# EAGLE design EnergyPal_v1.0 (EAGLE 9.7.0)
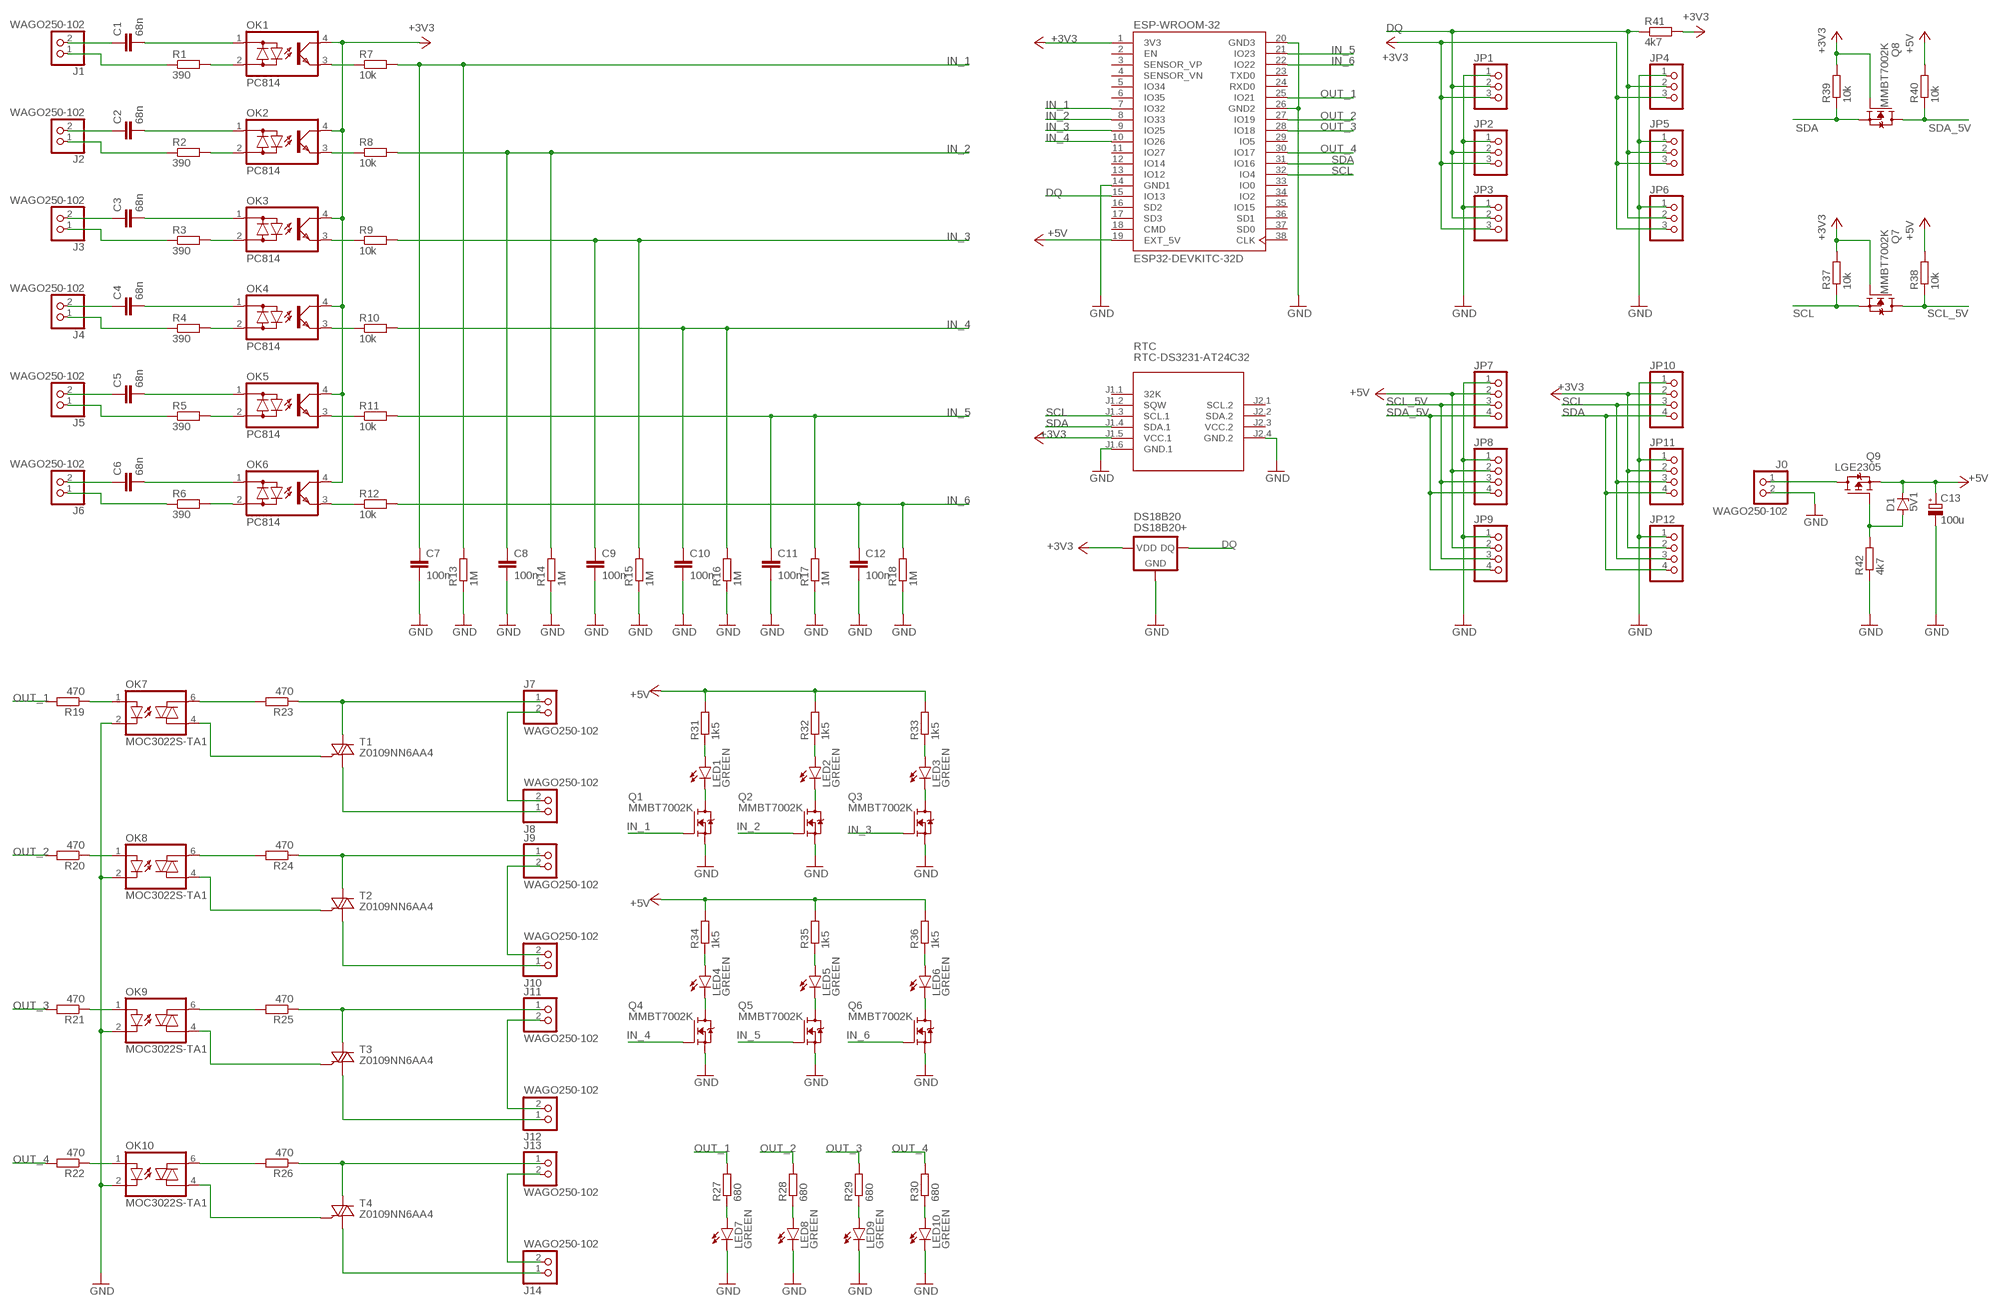
[diagram p0: schematic, sheet 1]

## Parts
C1  68n  C-EU075-063X106  [C075-063X106]
C2  68n  C-EU075-063X106  [C075-063X106]
C3  68n  C-EU075-063X106  [C075-063X106]
C4  68n  C-EU075-063X106  [C075-063X106]
C5  68n  C-EU075-063X106  [C075-063X106]
C6  68n  C-EU075-063X106  [C075-063X106]
C7  100n  C-EUC1206  [C1206]
C8  100n  C-EUC1206  [C1206]
C9  100n  C-EUC1206  [C1206]
C10  100n  C-EUC1206  [C1206]
C11  100n  C-EUC1206  [C1206]
C12  100n  C-EUC1206  [C1206]
C13  100u  CPOL-EUUD-6,3X7,7  [UD-6,3X7,7_NICHICON]
D1  5V1  DDZ9689-7  [SOD123]
DS18B20  DS18B20+  [TO92-]
ESP-WROOM-32  ESP32-DEVKITC-32D  [MODULE_ESP32-DEVKITC-32D]
J0  WAGO250-102  [250102]
J1  WAGO250-102  [250102]
J2  WAGO250-102  [250102]
J3  WAGO250-102  [250102]
J4  WAGO250-102  [250102]
J5  WAGO250-102  [250102]
J6  WAGO250-102  [250102]
J7  WAGO250-102  [250102]
J8  WAGO250-102  [250102]
J9  WAGO250-102  [250102]
J10  WAGO250-102  [250102]
J11  WAGO250-102  [250102]
J12  WAGO250-102  [250102]
J13  WAGO250-102  [250102]
J14  WAGO250-102  [250102]
JP1  PINHD-1X3  [1X03]
JP2  PINHD-1X3  [1X03]
JP3  PINHD-1X3  [1X03]
JP4  PINHD-1X3  [1X03]
JP5  PINHD-1X3  [1X03]
JP6  PINHD-1X3  [1X03]
JP7  PINHD-1X4  [1X04]
JP8  PINHD-1X4  [1X04]
JP9  PINHD-1X4  [1X04]
JP10  PINHD-1X4  [1X04]
JP11  PINHD-1X4  [1X04]
JP12  PINHD-1X4  [1X04]
LED1  GREEN  LEDSMT1206  [1206]
LED2  GREEN  LEDSMT1206  [1206]
LED3  GREEN  LEDSMT1206  [1206]
LED4  GREEN  LEDSMT1206  [1206]
LED5  GREEN  LEDSMT1206  [1206]
LED6  GREEN  LEDSMT1206  [1206]
LED7  GREEN  LEDSMT1206  [1206]
LED8  GREEN  LEDSMT1206  [1206]
LED9  GREEN  LEDSMT1206  [1206]
LED10  GREEN  LEDSMT1206  [1206]
OK1  PC814  [SOP254P960X420-4N]
OK2  PC814  [SOP254P960X420-4N]
OK3  PC814  [SOP254P960X420-4N]
OK4  PC814  [SOP254P960X420-4N]
OK5  PC814  [SOP254P960X420-4N]
OK6  PC814  [SOP254P960X420-4N]
OK7  MOC3022S-TA1  [SOP254P1016X460-6N]
OK8  MOC3022S-TA1  [SOP254P1016X460-6N]
OK9  MOC3022S-TA1  [SOP254P1016X460-6N]
OK10  MOC3022S-TA1  [SOP254P1016X460-6N]
Q1  MMBT7002K  [SOT23]
Q2  MMBT7002K  [SOT23]
Q3  MMBT7002K  [SOT23]
Q4  MMBT7002K  [SOT23]
Q5  MMBT7002K  [SOT23]
Q6  MMBT7002K  [SOT23]
Q7  MMBT7002K  [SOT23]
Q8  MMBT7002K  [SOT23]
Q9  LGE2305  [SOT23]
R1  390  R-EU_R1206  [R1206]
R2  390  R-EU_R1206  [R1206]
R3  390  R-EU_R1206  [R1206]
R4  390  R-EU_R1206  [R1206]
R5  390  R-EU_R1206  [R1206]
R6  390  R-EU_R1206  [R1206]
R7  10k  R-EU_R1206  [R1206]
R8  10k  R-EU_R1206  [R1206]
R9  10k  R-EU_R1206  [R1206]
R10  10k  R-EU_R1206  [R1206]
R11  10k  R-EU_R1206  [R1206]
R12  10k  R-EU_R1206  [R1206]
R13  1M  R-EU_R1206  [R1206]
R14  1M  R-EU_R1206  [R1206]
R15  1M  R-EU_R1206  [R1206]
R16  1M  R-EU_R1206  [R1206]
R17  1M  R-EU_R1206  [R1206]
R18  1M  R-EU_R1206  [R1206]
R19  470  R-EU_R1206  [R1206]
R20  470  R-EU_R1206  [R1206]
R21  470  R-EU_R1206  [R1206]
R22  470  R-EU_R1206  [R1206]
R23  470  R-EU_R1206  [R1206]
R24  470  R-EU_R1206  [R1206]
R25  470  R-EU_R1206  [R1206]
R26  470  R-EU_R1206  [R1206]
R27  680  R-EU_R1206  [R1206]
R28  680  R-EU_R1206  [R1206]
R29  680  R-EU_R1206  [R1206]
R30  680  R-EU_R1206  [R1206]
R31  1k5  R-EU_R1206  [R1206]
R32  1k5  R-EU_R1206  [R1206]
R33  1k5  R-EU_R1206  [R1206]
R34  1k5  R-EU_R1206  [R1206]
R35  1k5  R-EU_R1206  [R1206]
R36  1k5  R-EU_R1206  [R1206]
R37  10k  R-EU_R1206  [R1206]
R38  10k  R-EU_R1206  [R1206]
R39  10k  R-EU_R1206  [R1206]
R40  10k  R-EU_R1206  [R1206]
R41  4k7  R-EU_R1206  [R1206]
R42  4k7  R-EU_R1206  [R1206]
RTC  RTC-DS3231-AT24C32  [RTC-DS3231-AT24C32#MIRROR]
T1  Z0109NN6AA4  [SOT230P700X190-4N]
T2  Z0109NN6AA4  [SOT230P700X190-4N]
T3  Z0109NN6AA4  [SOT230P700X190-4N]
T4  Z0109NN6AA4  [SOT230P700X190-4N]

## Nets
+3V3: DS18B20.3(VDD) ESP-WROOM-32.1(3V3) JP1.3 JP2.3 JP3.3 JP4.3 JP5.3 JP6.3 JP10.2 JP11.2 JP12.2 OK1.4(C) OK2.4(C) OK3.4(C) OK4.4(C) OK5.4(C) OK6.4(C) Q7.1(G) Q8.1(G) R37.2 R39.2 R41.2 RTC.J1.5(VCC.1)
+5V: C13.+ D1.C ESP-WROOM-32.19(EXT_5V) JP7.2 JP8.2 JP9.2 Q9.2(S) R31.2 R32.2 R33.2 R34.2 R35.2 R36.2 R38.2 R40.2
DQ: DS18B20.2(DQ) ESP-WROOM-32.15(IO13) JP1.2 JP2.2 JP3.2 JP4.2 JP5.2 JP6.2 R41.1
GND: C7.2 C8.2 C9.2 C10.2 C11.2 C12.2 C13.- DS18B20.1(GND) ESP-WROOM-32.14(GND1) ESP-WROOM-32.20(GND3) ESP-WROOM-32.26(GND2) J0.2 JP1.1 JP2.1 JP3.1 JP4.1 JP5.1 JP6.1 JP7.1 JP8.1 JP9.1 JP10.1 JP11.1 JP12.1 LED7.C LED8.C LED9.C LED10.C OK7.2(C) OK8.2(C) OK9.2(C) OK10.2(C) Q1.2(S) Q2.2(S) Q3.2(S) Q4.2(S) Q5.2(S) Q6.2(S) R13.1 R14.1 R15.1 R16.1 R17.1 R18.1 R42.1 RTC.J1.6(GND.1) RTC.J2.4(GND.2)
IN_1: C7.1 ESP-WROOM-32.7(IO32) Q1.1(G) R7.2 R13.2
IN_2: C8.1 ESP-WROOM-32.8(IO33) Q2.1(G) R8.2 R14.2
IN_3: C9.1 ESP-WROOM-32.9(IO25) Q3.1(G) R9.2 R15.2
IN_4: C10.1 ESP-WROOM-32.10(IO26) Q4.1(G) R10.2 R16.2
IN_5: C11.1 ESP-WROOM-32.21(IO23) Q5.1(G) R11.2 R17.2
IN_6: C12.1 ESP-WROOM-32.22(IO22) Q6.1(G) R12.2 R18.2
N$1: C1.1 J1.2
N$2: C1.2 OK1.1(AC1)
N$3: OK6.2(AC2) R6.2
N$4: J6.1 R6.1
N$5: C2.1 J2.2
N$6: C2.2 OK2.1(AC1)
N$7: J2.1 R2.1
N$8: OK2.2(AC2) R2.2
N$9: OK4.3(E) R10.1
N$10: OK3.3(E) R9.1
N$11: OK2.3(E) R8.1
N$12: OK1.3(E) R7.1
N$13: OK7.1(A) R19.1
N$14: OK7.6(A2) R23.2
N$15: OK8.1(A) R20.1
N$16: J1.1 R1.1
N$17: OK8.6(A2) R24.2
N$18: OK1.2(AC2) R1.2
N$19: C3.1 J3.2
N$20: J9.1 R24.1 T2.2(A2) T2.4(A2)
N$21: OK8.4(A1) T2.3(G)
N$22: J10.1 T2.1(A1)
N$23: J9.2 J10.2
N$24: J0.1 Q9.3(D)
N$25: C3.2 OK3.1(AC1)
N$26: OK9.1(A) R21.1
N$27: J7.2 J8.2
N$28: OK9.6(A2) R25.2
N$29: J3.1 R3.1
N$30: OK3.2(AC2) R3.2
N$31: J11.1 R25.1 T3.2(A2) T3.4(A2)
N$32: OK9.4(A1) T3.3(G)
N$33: C4.1 J4.2
N$34: C4.2 OK4.1(AC1)
N$35: J4.1 R4.1
N$36: OK4.2(AC2) R4.2
N$37: C5.1 J5.2
N$38: C5.2 OK5.1(AC1)
N$39: J5.1 R5.1
N$40: LED1.C Q1.3(D)
N$41: D1.A Q9.1(G) R42.2
N$42: LED7.A R27.1
N$43: LED1.A R31.1
N$44: LED2.A R32.1
N$45: LED2.C Q2.3(D)
N$46: LED8.A R28.1
N$47: LED3.A R33.1
N$48: LED3.C Q3.3(D)
N$49: OK5.2(AC2) R5.2
N$50: LED9.A R29.1
N$51: C6.1 J6.2
N$52: OK5.3(E) R11.1
N$53: C6.2 OK6.1(AC1)
N$55: OK6.3(E) R12.1
N$57: LED4.A R34.1
N$59: LED4.C Q4.3(D)
N$61: LED10.A R30.1
N$63: LED5.A R35.1
N$65: LED5.C Q5.3(D)
N$67: J7.1 R23.1 T1.2(A2) T1.4(A2)
N$69: LED6.A R36.1
N$70: LED6.C Q6.3(D)
N$71: OK7.4(A1) T1.3(G)
N$72: J8.1 T1.1(A1)
N$73: J12.1 T3.1(A1)
N$75: J11.2 J12.2
N$77: OK10.1(A) R22.1
N$78: OK10.6(A2) R26.2
N$81: J13.1 R26.1 T4.2(A2) T4.4(A2)
N$82: OK10.4(A1) T4.3(G)
N$83: J14.1 T4.1(A1)
N$84: J13.2 J14.2
OUT_1: ESP-WROOM-32.25(IO21) R19.2 R27.2
OUT_2: ESP-WROOM-32.27(IO19) R20.2 R28.2
OUT_3: ESP-WROOM-32.28(IO18) R21.2 R29.2
OUT_4: ESP-WROOM-32.30(IO17) R22.2 R30.2
SCL: ESP-WROOM-32.32(IO4) JP10.3 JP11.3 JP12.3 Q7.2(S) R37.1 RTC.J1.3(SCL.1)
SCL_5V: JP7.3 JP8.3 JP9.3 Q7.3(D) R38.1
SDA: ESP-WROOM-32.31(IO16) JP10.4 JP11.4 JP12.4 Q8.2(S) R39.1 RTC.J1.4(SDA.1)
SDA_5V: JP7.4 JP8.4 JP9.4 Q8.3(D) R40.1
Unconnected: ESP-WROOM-32.2(EN) ESP-WROOM-32.3(SENSOR_VP) ESP-WROOM-32.4(SENSOR_VN) ESP-WROOM-32.5(IO34) ESP-WROOM-32.6(IO35) ESP-WROOM-32.11(IO27) ESP-WROOM-32.12(IO14) ESP-WROOM-32.13(IO12) ESP-WROOM-32.16(SD2) ESP-WROOM-32.17(SD3) ESP-WROOM-32.18(CMD) ESP-WROOM-32.23(TXD0) ESP-WROOM-32.24(RXD0) ESP-WROOM-32.29(IO5) ESP-WROOM-32.33(IO0) ESP-WROOM-32.34(IO2) ESP-WROOM-32.35(IO15) ESP-WROOM-32.36(SD1) ESP-WROOM-32.37(SD0) ESP-WROOM-32.38(CLK) RTC.J1.1(32K) RTC.J1.2(SQW) RTC.J2.1(SCL.2) RTC.J2.2(SDA.2)

## Power pins joined to a net without a drawn wire
VCC.2: RTC.J2.3(VCC.2)

## Library data of the parts
C1-C12 = rcl:C-EU: CAPACITOR, European symbol; SPICEPREFIX: C
C13 = rcl:CPOL-EU: POLARIZED CAPACITOR, European symbol; SPICEPREFIX: C
D1 = Spectrasol:DDZ9689-7
DS18B20 = Spectrasol:DS18B20
ESP-WROOM-32 = diy-modules:ESP32-DEVKITC-32D: Eval Board For Esp-Wroom-32; AVAILABILITY: Unavailable; DESCRIPTION: - Transceiver; 802.11 b/g/n _Wi-Fi, WiFi, WLAN_, Bluetooth® Smart Ready 4.x Dual Mode For Use With ESP-WROOM-32; MF: Espressif Systems; MP: ESP32-DEVKITC-32D; PACKAGE: None; PRICE: None
J0 J1-J14 = LUNA Controller:WAGO250-102: PCB terminal block; push-button; 1.5 mm; Pin spacing 3.5 mm; 2-pole; Push-in CAGE CLAMP Source: Datasheet <https://www.wago.com/250-102>; DESCRIPTION: PCB terminal block; push-button; 1.5 mm; Pin spacing 3.5 mm; 2-pole; Push-in CAGE CLAMP; HEIGHT: 13.1mm; MANUFACTURER_NAME: Wago; MANUFACTURER_PART_NUMBER: 250-102
JP1-JP6 = pinhead:PINHD-1X3: PIN HEADER
JP7-JP12 = pinhead:PINHD-1X4: PIN HEADER
LED1-LED10 = led:LED: LED OSRAM: - CHIPLED LG R971, LG N971, LY N971, LG Q971, LY Q971, LO R971, LY R971 LH N974, LH R974 LS Q976, LO Q976, LY Q976 LO Q996 - Hyper CHIPLED LW Q18S LB Q993, LB Q99A, LB R99A - SideLED LS A670, LO A670, LY A670, LG A670, LP A670 LB A673, LV A673, LT A673, LW A673 LH A674 LY A675 LS A676, LA A676, LO A676, LY A676, LW A676 LS A679, LY A679, LG A679 - Hyper Micro SIDELED® LS Y876, LA Y876, LO Y876, LY Y876 LT Y87S - SmartLED LW L88C, LW L88S LB L89C, LB L89S, LG L890 LS L89K, LO L89K, LY L89K LS L896, LA L896, LO L896, LY L896 - TOPLED LS T670, LO T670, LY T670, LG T670, LP T670 LSG T670, LSP T670, LSY T670, LOP T670, LYG T670 LG T671, LOG T671, LSG T671 LB T673, LV T673, LT T673, LW T673 LH T674 LS T676, LA T676, LO T676, LY T676, LB T676, LH T676, LSB T676, LW T676 LB T67C, LV T67C, LT T67C, LS T67K, LO T67K, LY T67K, LW E67C LS E67B, LA E67B, LO E67B, LY E67B, LB E67C, LV E67C, LT E67C LW T67C LS T679, LY T679, LG T679 LS T770, LO T770, LY T770, LG T770, LP T770 LB T773, LV T773, LT T773, LW T773 LH T774 LS E675, LA E675, LY E675, LS T675 LS T776, LA T776, LO T776, LY T776, LB T776 LHGB T686 LT T68C, LB T68C - Hyper Mini TOPLED® LB M676 - Mini TOPLED Santana® LG M470 LS M47K, LO M47K, LY M47K Source: http://www.osram.convergy.de LUXEON: - LUMILED® LXK2-PW12-R00, LXK2-PW12-S00, LXK2-PW14-U00, LXK2-PW14-V00 LXK2-PM12-R00, LXK2-PM12-S00, LXK2-PM14-U00 LXK2-PE12-Q00, LXK2-PE12-R00, LXK2-PE12-S00, LXK2-PE14-T00, LXK2-PE14-U00 LXK2-PB12-K00, LXK2-PB12-L00, LXK2-PB12-M00, LXK2-PB14-N00, LXK2-PB14-P00, LXK2-PB14-Q00 LXK2-PR12-L00, LXK2-PR12-M00, LXK2-PR14-Q00, LXK2-PR14-R00 LXK2-PD12-Q00, LXK2-PD12-R00, LXK2-PD12-S00 LXK2-PH12-R00, LXK2-PH12-S00 LXK2-PL12-P00, LXK2-PL12-Q00, LXK2-PL12-R00 Source: www.luxeon.com KINGBRIGHT: KA-3528ASYC Source: www.kingbright.com
OK1-OK6 = maturitni_prace:PC814
OK7-OK10 = maturitni_prace:MOC3022S-TA1
Q1-Q8 = DoorOpener:MMBT7002K
Q9 = Spectrasol:LGE2305
R1-R42 = rcl:R-EU_: RESISTOR, European symbol; SPICEPREFIX: R
RTC = maturitni_prace:RTC-DS3231-AT24C32
T1-T4 = maturitni_prace:Z0109NN6AA4

## Board
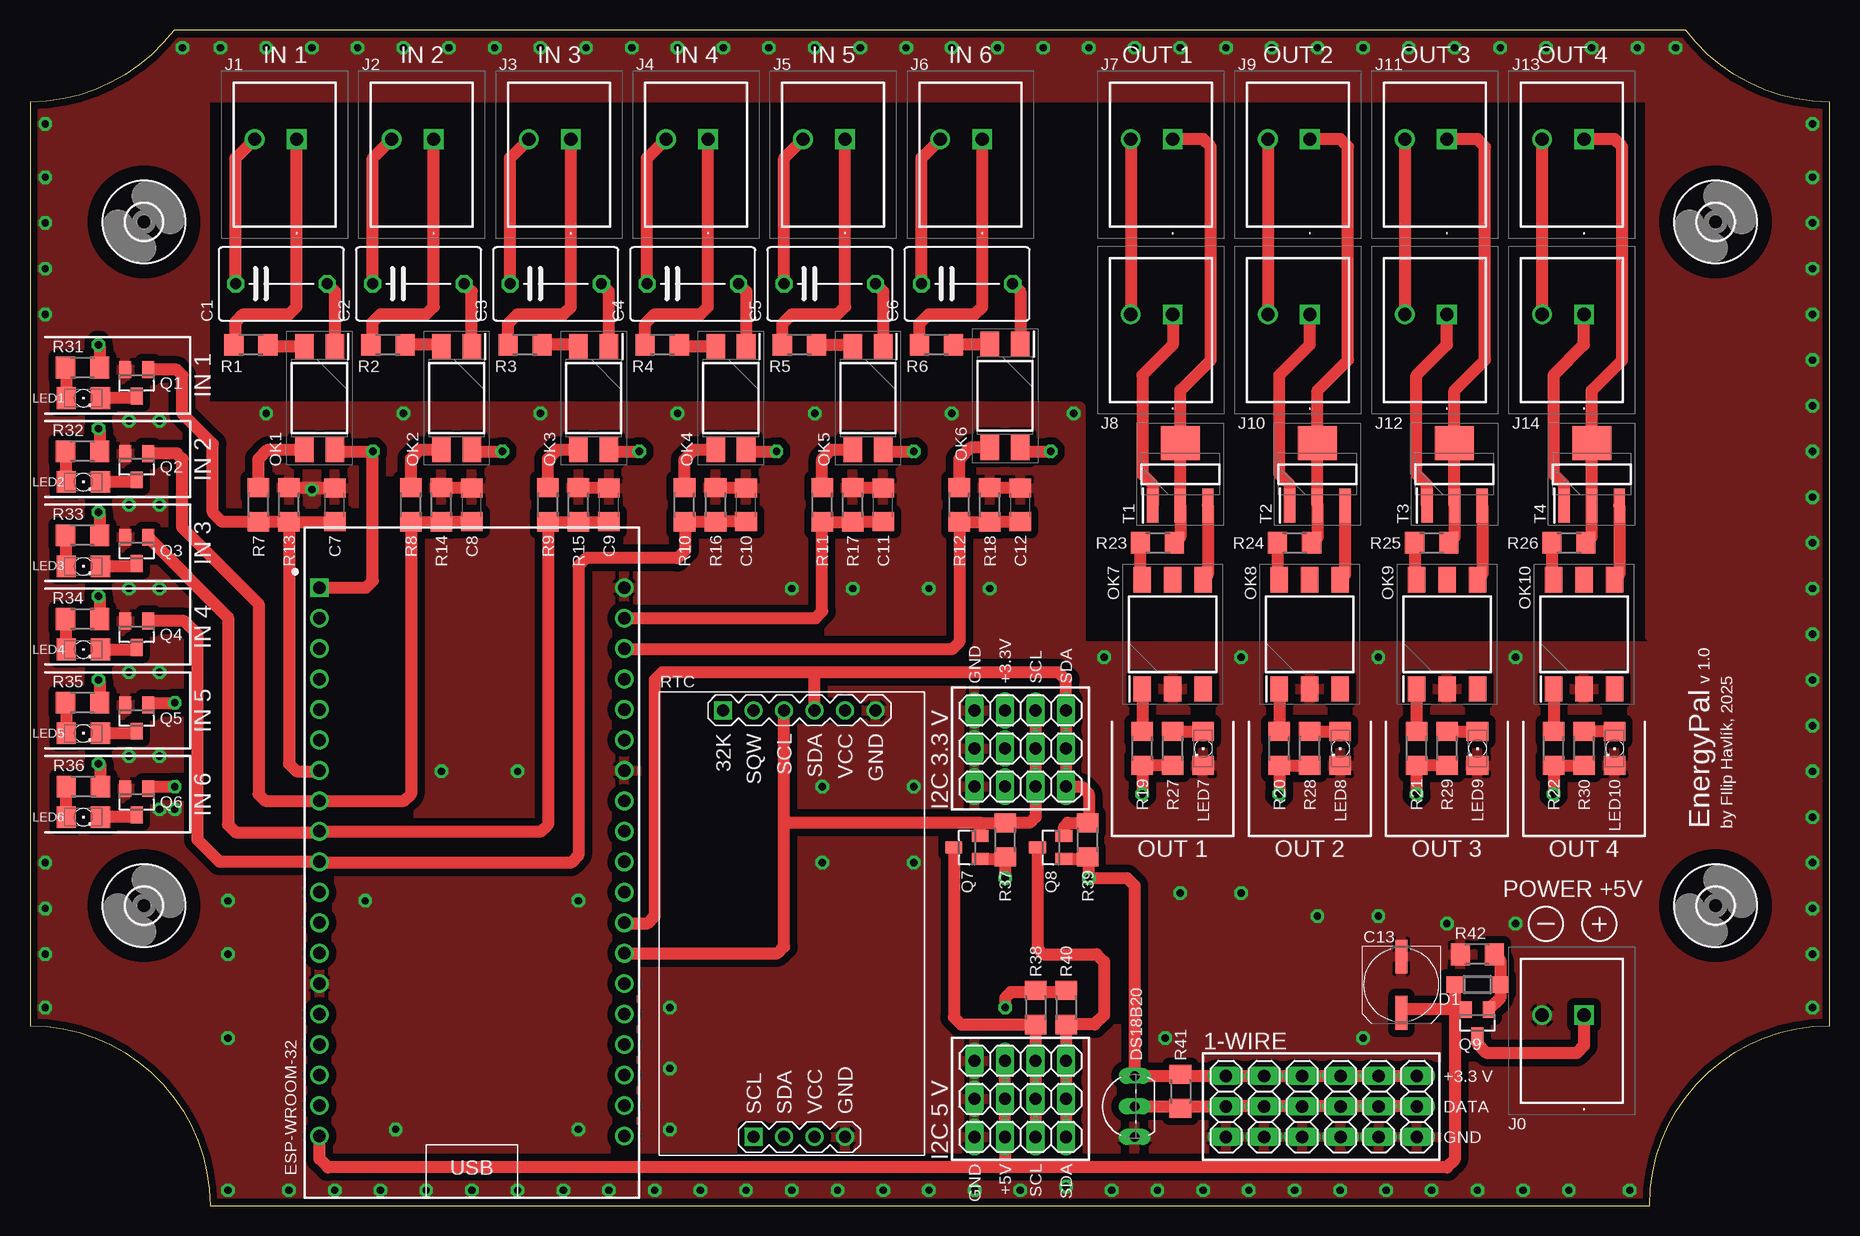
[diagram p1: board, top side]
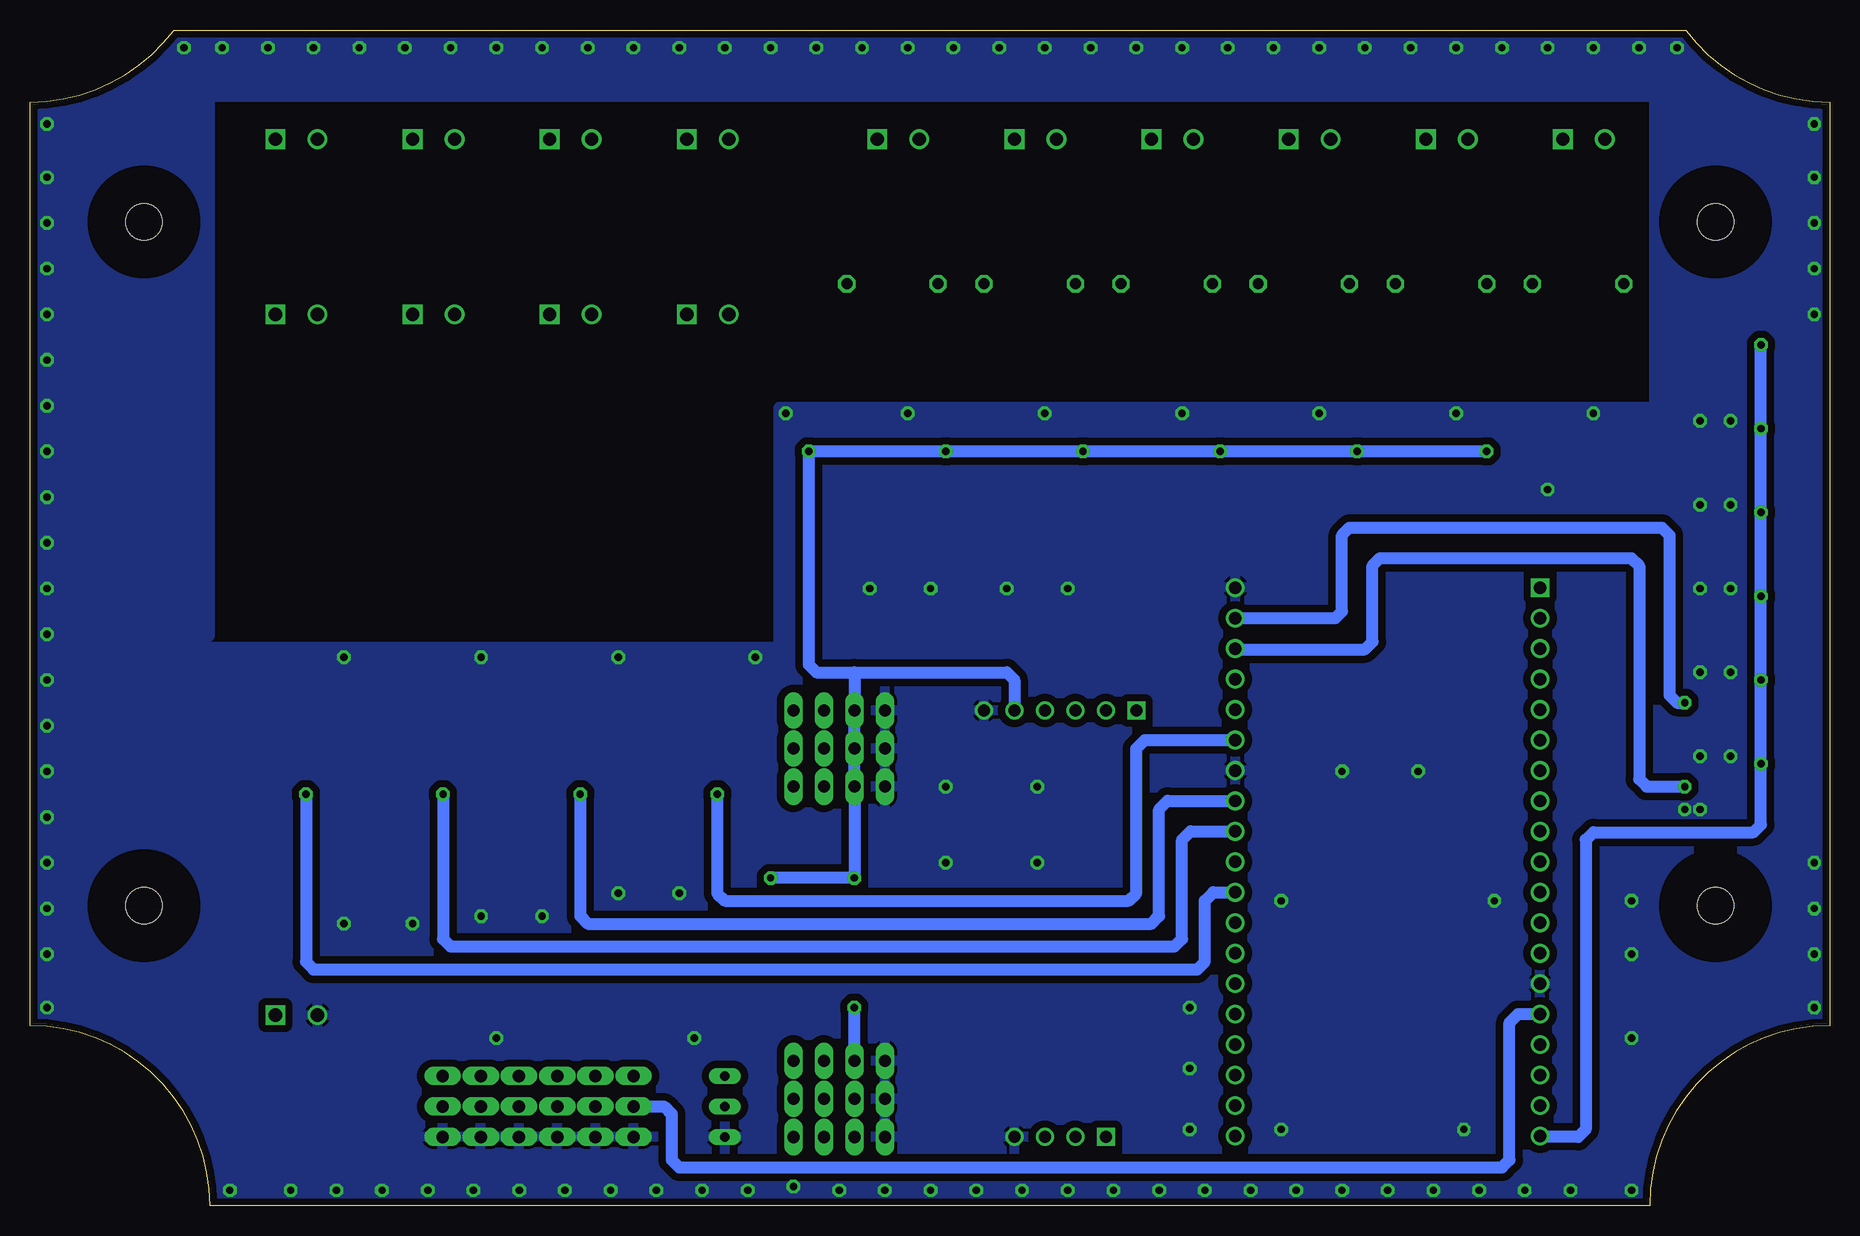
[diagram p2: board, bottom side, seen from below]

Size 150 x 98 mm. Coordinates in mm from the lower left corner, seen from the top.
Outline: 15,0 135,0 arc-90 150,15 150,92 arc-53 138,98 12,98 arc-53 0,92 0,15 arc-90 15,0
Copper layers (1*16): Top 0.035mm / dielectric 1.5mm / Bottom 0.035mm
Design rules "gatema.dru": minimum track width 8mil, minimum drill 8mil, track to track 4mil, track to pad 4mil, pad to pad 4mil, via to via 4mil, smd to smd 4mil, copper to edge 8mil, drill to drill 8mil, minimum pad ring 10mil, minimum via ring 10mil, stop-mask expansion 2mil, vias tented up to drill 0mil, thermal gap 10mil

### Footprints (pad centres in the part's own frame; a part is rotated, then mirrored left to right if it is on the bottom)
C075-063X106 = drill 0.914 octagon: 1 -3.81,0; 2 3.81,0
C1206 = smd 1.6 x 1.8: 1 -1.4,0; 2 1.4,0
UD-6,3X7,7_NICHICON = smd 2.8 x 1: + 2.35,0; - -2.35,0
SOD123 = smd 1.4 x 1.4: A 1.9,0; C -1.9,0
TO92- = drill 0.813 long: 1 -2.54,0; 2 0,0; 3 2.54,0
MODULE_ESP32-DEVKITC-32D = drill 1.04 square: 1 -12.7,19.76 | drill 1.04: 2 -12.7,17.22; 3 -12.7,14.68; 4 -12.7,12.14; 5 -12.7,9.6; 6 -12.7,7.06; 7 -12.7,4.52; 8 -12.7,1.98; 9 -12.7,-0.56; 10 -12.7,-3.1; 11 -12.7,-5.64; 12 -12.7,-8.18; 13 -12.7,-10.72; 14 -12.7,-13.26; 15 -12.7,-15.8; 16 -12.7,-18.34; 17 -12.7,-20.88; 18 -12.7,-23.42; 19 -12.7,-25.96; 20 12.7,19.76; 21 12.7,17.22; 22 12.7,14.68; 23 12.7,12.14; 24 12.7,9.6; 25 12.7,7.06; 26 12.7,4.52; 27 12.7,1.98; 28 12.7,-0.56; 29 12.7,-3.1; 30 12.7,-5.64; 31 12.7,-8.18; 32 12.7,-10.72; 33 12.7,-13.26; 34 12.7,-15.8; 35 12.7,-18.34; 36 12.7,-20.88; 37 12.7,-23.42; 38 12.7,-25.96
250102 = drill 1.1 pad 1.65 square: 1 0,0 | drill 1.1 pad 1.65: 2 3.5,0
1X03 = drill 1.016 long: 1 -2.54,0; 2 0,0; 3 2.54,0
1X04 = drill 1.016 long: 1 -3.81,0; 2 -1.27,0; 3 1.27,0; 4 3.81,0
1206 = smd 1.6 x 1.803: A -1.422,0; C 1.422,0
SOP254P960X420-4N = smd 2.1 x 1.55: 1 -4.3,1.27; 2 -4.3,-1.27; 3 4.3,-1.27; 4 4.3,1.27
SOP254P1016X460-6N = smd 2.1 x 1.45: 1 -4.55,2.54; 2 -4.55,0; 3 -4.55,-2.54; 4 4.55,-2.54; 5 4.55,0; 6 4.55,2.54
SOT23 = smd 1 x 1.4: 1 -0.95,-1.1; 2 0.95,-1.1; 3 0,1.1
R1206 = smd 1.6 x 1.803: 1 -1.422,0; 2 1.422,0
RTC-DS3231-AT24C32#MIRROR = drill 1 square: J1.1 17.78,6.35; J2.1 -17.78,3.81 | drill 1: J1.2 17.78,3.81; J1.3 17.78,1.27; J1.4 17.78,-1.27; J1.5 17.78,-3.81; J1.6 17.78,-6.35; J2.2 -17.78,1.27; J2.3 -17.78,-1.27; J2.4 -17.78,-3.81
SOT230P700X190-4N = smd 2.85 x 0.95: 1 -2.6,2.3; 2 -2.6,0; 3 -2.6,-2.3 | smd 2.85 x 3.25: 4 2.6,0
3,0 = hole 3: 0,0

### Placement (x,y rotation side)
C1  20.95,76.83 0 top
C2  32.38,76.83 0 top
C3  43.81,76.83 0 top
C4  55.24,76.83 0 top
C5  66.67,76.83 0 top
C6  78.11,76.83 0 top
C7  25.4,58.42 90 top
C8  36.83,58.42 90 top
C9  48.26,58.42 90 top
C10  59.69,58.42 90 top
C11  71.12,58.42 90 top
C12  82.55,58.42 90 top
C13  114.3,18.41 270 top
D1  120.65,18.41 0 top
DS18B20  92.08,8.26 90 top
ESP-WROOM-32  36.83,31.75 0 top
J0  129.54,15.88 180 top
J1  22.23,88.9 180 top
J2  33.66,88.9 180 top
J3  45.09,88.9 180 top
J4  56.52,88.9 180 top
J5  67.94,88.9 180 top
J6  79.38,88.9 180 top
J7  95.25,88.9 180 top
J8  95.25,74.3 180 top
J9  106.68,88.9 180 top
J10  106.68,74.3 180 top
J11  118.11,88.9 180 top
J12  118.11,74.3 180 top
J13  129.54,88.9 180 top
J14  129.54,74.3 180 top
JP1  115.6,8.26 90 top
JP2  112.42,8.26 90 top
JP3  109.25,8.26 90 top
JP4  106.05,8.26 90 top
JP5  102.87,8.26 90 top
JP6  99.69,8.26 90 top
JP7  82.55,12.06 0 top
JP8  82.55,8.89 0 top
JP9  82.55,5.71 0 top
JP10  82.55,41.27 0 top
JP11  82.55,38.1 0 top
JP12  82.55,34.92 0 top
LED1  4.45,67.31 0 top
LED2  4.45,60.33 0 top
LED3  4.45,53.29 0 top
LED4  4.45,46.35 0 top
LED5  4.45,39.37 0 top
LED6  4.45,32.38 0 top
LED7  97.79,38.1 270 top
LED8  109.22,38.1 270 top
LED9  120.65,38.1 270 top
LED10  132.08,38.1 270 top
OK1  24.13,67.31 270 top
OK2  35.56,67.31 270 top
OK3  46.99,67.31 270 top
OK4  58.42,67.31 270 top
OK5  69.85,67.31 270 top
OK6  81.28,67.51 270 top
OK7  95.25,47.62 90 top
OK8  106.68,47.62 90 top
OK9  118.11,47.62 90 top
OK10  129.54,47.62 90 top
Q1  8.89,68.58 180 top
Q2  8.89,61.59 180 top
Q3  8.89,54.61 180 top
Q4  8.89,47.62 180 top
Q5  8.89,40.64 180 top
Q6  8.89,33.66 180 top
Q7  78.11,29.84 90 top
Q8  85.09,29.84 90 top
Q9  120.65,15.24 180 top
R1  18.41,71.75 0 top
R2  29.84,71.75 0 top
R3  41.27,71.75 0 top
R4  52.7,71.75 0 top
R5  64.14,71.75 0 top
R6  75.56,71.75 0 top
R7  19.05,58.42 270 top
R8  31.75,58.42 270 top
R9  43.18,58.42 270 top
R10  54.56,58.42 270 top
R11  66.04,58.42 270 top
R12  77.47,58.42 270 top
R13  21.59,58.42 270 top
R14  34.29,58.42 270 top
R15  45.72,58.42 270 top
R16  57.15,58.42 270 top
R17  68.58,58.42 270 top
R18  80.01,58.42 270 top
R19  92.71,38.1 270 top
R20  104.14,38.1 270 top
R21  115.57,38.1 270 top
R22  127,38.1 270 top
R23  93.98,55.24 180 top
R24  105.41,55.24 180 top
R25  116.84,55.24 180 top
R26  128.27,55.24 180 top
R27  95.25,38.1 270 top
R28  106.68,38.1 270 top
R29  118.11,38.1 270 top
R30  129.54,38.1 270 top
R31  4.38,69.85 0 top
R32  4.38,62.87 0 top
R33  4.38,55.88 0 top
R34  4.38,48.9 0 top
R35  4.38,41.91 0 top
R36  4.45,34.92 0 top
R37  81.28,30.48 270 top
R38  83.82,16.51 90 top
R39  88.16,30.48 270 top
R40  86.36,16.51 90 top
R41  95.9,9.53 90 top
R42  120.65,20.94 0 top
RTC  64.14,23.5 90 top
T1  95.89,60.96 90 top
T2  107.31,60.96 90 top
T3  118.75,60.96 90 top
T4  130.18,60.96 90 top
U$8  [3,0]  9.5,25 0 top
U$9  [3,0]  9.5,82 0 top
U$10  [3,0]  140.5,82 0 top
U$11  [3,0]  140.5,25 0 top

### Tracks (layer width: path | path; a pad name or v marks a point on that pad's centre or on a via)
+3V3  (via drill 0.61)
  Top 1.016: JP1.3 JP2.3 JP3.3 JP4.3 JP5.3 JP6.3 96.05,10.79 R41.2 95.75,10.79 DS18B20.3 92.08,26.67 91.44,27.3 v88.27,27.3 88.27,28.96 R39.2 88,28.89 Q8.1 | OK1.4 25.55,62.87 v28.57,62.87 28.57,52.07 28.02,51.51 ESP-WROOM-32.1 | OK2.4 36.98,62.87 v39.37,62.87 | OK3.4 48.41,62.87 v50.8,62.87 | OK4.4 59.84,62.87 v62.23,62.87 | OK5.4 71.27,62.87 v73.66,62.87 | OK6.4 82.89,62.87 v85.09,62.87 | Q7.1 81.12,28.89 R37.2 v81.28,27.3
  Bottom 1.016: v28.57,62.87 v39.37,62.87 v50.8,62.87 v62.23,62.87 v73.66,62.87 v85.09,62.87 85.09,45.09 84.45,44.45 81.28,44.45 | 81.28,44.45 JP10.2 JP11.2 JP12.2 v81.28,27.3 v88.27,27.3 | 81.28,44.45 68.58,44.45 67.94,43.81 RTC.J1.5
+5V  (via drill 0.61)
  Top 1.016: JP7.2 JP8.2 JP9.2 81.28,3.17 | v5.71,36.83 5.87,36.68 R36.2 | v5.71,43.81 5.8,43.73 R35.2 | v5.71,50.8 5.8,50.71 R34.2 | v5.71,57.78 5.8,57.7 R33.2 | v5.71,64.77 5.8,64.68 R32.2 | v5.71,71.75 5.8,71.67 R31.2 | 118.75,16.34 Q9.2 | 118.75,16.34 114.47,16.34 114.3,16.51 C13.+ | 118.75,16.34 118.75,3.81 118.11,3.17 81.28,3.17 | v81.28,16.51 81.28,17.3 81.76,17.78 83.67,17.78 | 83.67,17.78 R38.2 | R40.2 86.21,17.78 83.67,17.78 | 81.28,3.17 24.84,3.17 24.13,3.88 ESP-WROOM-32.19 | D1.C 118.75,16.34
  Bottom 1.016: v5.71,71.75 v5.71,64.77 v5.71,57.78 v5.71,50.8 v5.71,43.81 v5.71,36.83 5.71,31.75 6.35,31.11 19.68,31.11 20.32,30.48 20.32,6.35 20.95,5.71 24.05,5.71 ESP-WROOM-32.19 | JP7.2 v81.28,16.51
DQ
  Top 1.016: JP1.2 JP2.2 JP3.2 JP4.2 JP5.2 JP6.2 96.05,8.26 R41.1 95.75,8.26 DS18B20.2
  Bottom 1.016: JP6.2 97.16,8.26 96.52,7.62 96.52,3.81 95.89,3.17 27.3,3.17 26.67,3.81 26.67,15.24 25.96,15.95 ESP-WROOM-32.15
GND  (via drill 0.61)
  Top 0.813: 82.68,59.69 C12.2 | 80.03,59.82 R18.1 | 71.1,59.84 C11.2 | 36.81,59.84 C8.2 | 25.38,59.84 C7.2 | 59.69,59.51 C10.2
  Top 1.016: C12.2 80.03,59.82 | C11.2 68.58,59.82 R17.1 | C10.2 57.15,59.82 R16.1 | C9.2 45.72,59.82 R15.1 | C8.2 34.29,59.82 R14.1 | R13.1 21.59,59.82 C7.2 23.62,59.82 v23.5,59.69
  other vias: 66.04,28.57 73.66,28.57 66.04,34.92 73.66,34.92 8.26,65.41 10.79,65.41 8.26,58.42 10.79,58.42 8.26,51.44 10.79,51.44 8.26,44.45 10.79,44.45 8.26,37.47 10.79,37.47 10.79,33.02 12.06,33.02 12.7,96.52 15.88,96.52 19.68,96.52 23.5,96.52 27.3,96.52 31.11,96.52 34.92,96.52 38.73,96.52 42.55,96.52 46.35,96.52 50.16,96.52 53.98,96.52 57.78,96.52 61.59,96.52 65.41,96.52 69.22,96.52 73.03,96.52 76.83,96.52 80.64,96.52 84.45,96.52 88.27,96.52 92.08,96.52 95.89,96.52 99.69,96.52 103.5,96.52 107.31,96.52 111.12,96.52 114.94,96.52 118.75,96.52 122.56,96.52 126.36,96.52 130.18,96.52 133.99,96.52 137.16,96.52 148.59,16.51 148.59,20.95 148.59,24.77 148.59,28.57 148.59,32.38 148.59,36.2 148.59,40.01 148.59,43.81 148.59,47.62 148.59,51.44 148.59,55.24 148.59,59.05 148.59,62.87 148.59,66.67 148.59,70.48 148.59,74.3 148.59,78.11 148.59,81.92 148.59,85.72 148.59,90.17 1.27,16.51 1.27,20.95 1.27,24.77 1.27,28.57 1.27,74.3 1.27,78.11 1.27,81.92 1.27,85.72 1.27,90.17 16.51,1.27 21.59,1.27 25.4,1.27 29.21,1.27 33.02,1.27 36.83,1.27 40.64,1.27 44.45,1.27 48.26,1.27 52.07,1.27 55.88,1.27 59.69,1.27 63.5,1.27 67.31,1.27 71.12,1.27 74.93,1.27 82.55,1.27 90.17,1.27 93.98,1.27 97.79,1.27 101.6,1.27 105.41,1.27 109.22,1.27 113.03,1.27 116.84,1.27 120.65,1.27 124.46,1.27 128.27,1.27 133.35,1.27 45.72,25.4 27.94,25.4 40.64,36.2 34.29,36.2 19.68,66.04 31.11,66.04 42.55,66.04 53.98,66.04 65.41,66.04 76.83,66.04 87,66.04 63.5,51.44 74.93,51.44 68.58,51.44 89.53,45.72 100.97,45.72 112.39,45.72 123.83,45.72 94.61,13.97 111.12,13.97 80.01,51.44 95.89,26.04 100.97,26.04 107.31,24.13 112.39,24.13 118.11,23.5 123.83,23.5 53.34,16.51 53.34,11.43 53.34,6.35 16.51,25.4 16.51,20.95 16.51,13.97 30.48,6.35 45.72,6.35 78.74,1.27 86.36,1.59
  pour Bottom (isolate 0.61): 87.59,46.95 87.59,66.59 14.95,66.59 14.84,66.62 14.75,66.67 14.67,66.75 14.62,66.84 14.59,66.95 14.59,97.59 0.41,97.59 0.41,0.41 149.59,0.41 149.59,97.59 135.04,97.59 135.04,47.41 135.05,47.41 135.16,47.38 135.25,47.33 135.33,47.25 135.38,47.16 135.41,47.05 135.41,46.95 135.38,46.84 135.33,46.75 135.25,46.67 135.16,46.62 135.05,46.59 87.95,46.59 87.84,46.62 87.75,46.67 87.67,46.75 87.62,46.84
  pour Top (isolate 0.61): 0.41,92.41 149.59,92.41 149.59,97.59 0.41,97.59
  pour Top (isolate 0.61): 87.59,46.95 87.59,66.59 14.95,66.59 14.84,66.62 14.75,66.67 14.67,66.75 14.62,66.84 14.59,66.95 14.59,97.59 0.41,97.59 0.41,0.41 149.59,0.41 149.59,97.59 135.04,97.59 135.04,47.41 135.05,47.41 135.16,47.38 135.25,47.33 135.33,47.25 135.38,47.16 135.41,47.05 135.41,46.95 135.38,46.84 135.33,46.75 135.25,46.67 135.16,46.62 135.05,46.59 87.95,46.59 87.84,46.62 87.75,46.67 87.67,46.75 87.62,46.84
  pour Bottom (isolate 0.61): 0.41,92.41 149.59,92.41 149.59,97.59 0.41,97.59
IN_1
  Top 1.016: R13.2 21.59,36.83 22.23,36.2 24.05,36.2 ESP-WROOM-32.7 | R13.2 R7.2 16.03,57 15.24,57.78 15.24,63.5 12.7,66.04 12.7,69.22 12.23,69.68 Q1.1 | R13.2 25.38,57 C7.1
IN_2
  Top 1.016: C8.1 34.31,57.02 R14.2 R8.2 31.75,34.29 31.19,33.73 ESP-WROOM-32.8 19.61,33.73 19.05,34.29 19.05,50.16 12.7,56.52 12.7,62.23 12.23,62.7 Q2.1
IN_3
  Top 1.016: C9.1 48.24,57 R15.2 R9.2 43.18,31.75 42.62,31.19 ESP-WROOM-32.9 24.05,31.11 17.14,31.11 16.51,31.75 16.51,49.04 Q3.1
IN_4
  Top 0.813: 57.17,57.02 R16.2
  Top 1.016: C10.1 57.17,57.02 | R16.2 R10.2 54.61,56.95 54.61,54.61 53.98,53.98 46.35,53.98 45.72,53.34 45.72,29.21 45.09,28.57 24.2,28.57 ESP-WROOM-32.10 15.8,28.65 13.97,30.48 13.97,47.62 12.87,48.73 Q4.1
IN_5  (via drill 0.61)
  Top 0.813: C11.1 71.1,57
  Top 1.016: 71.1,57 R17.2 R11.2 66.04,49.53 65.48,48.97 ESP-WROOM-32.21 | Q5.1 10.01,41.91 v12.06,41.91
  Bottom 1.016: ESP-WROOM-32.21 41.2,48.97 40.64,49.53 40.64,55.88 40.01,56.52 13.97,56.52 13.34,55.88 13.34,42.55 12.7,41.91 v12.06,41.91
IN_6  (via drill 0.61)
  Top 0.813: C12.1 82.53,57
  Top 1.016: 82.53,57 R18.2 R12.2 77.47,46.99 76.83,46.35 49.6,46.35 ESP-WROOM-32.22 | Q6.1 10.01,34.92 v12.06,34.92
  Bottom 1.016: ESP-WROOM-32.22 49.45,46.35 38.73,46.35 38.1,46.99 38.1,53.34 37.47,53.98 16.51,53.98 15.88,53.34 15.88,35.56 15.24,34.92 v12.06,34.92
N$1
  Top 1.016: C1.1 17.14,87.32 J1.2
N$2
  Top 1.016: C1.2 25.4,76.2 OK1.1
N$3
  Top 1.016: OK6.2 79.95,71.75 R6.2
N$4
  Top 1.016: R6.1 74.14,73.51 74.93,74.3 78.74,74.3 79.38,74.93 J6.1
N$5
  Top 1.016: C2.1 28.57,87.32 J2.2
N$6
  Top 1.016: OK2.1 36.83,76.2 C2.2
N$7
  Top 1.016: R2.1 28.57,71.91 28.57,73.66 29.21,74.3 33.02,74.3 33.66,74.93 J2.1
N$8
  Top 1.016: OK2.2 34.15,71.75 R2.2
N$9
  Top 1.016: R10.1 54.56,62.18 55.39,63.01 OK4.3
N$10
  Top 1.016: R9.1 43.18,62.23 43.96,63.01 OK3.3
N$11
  Top 1.016: R8.1 31.75,62.23 32.53,63.01 OK2.3
N$12
  Top 1.016: R7.1 19.05,62.23 19.83,63.01 OK1.3
N$13
  Top 1.016: OK7.1 R19.1
N$14
  Top 1.016: OK7.6 92.56,52.33 R23.2
N$15
  Top 1.016: OK8.1 R20.1
N$16
  Top 1.016: R1.1 17.14,71.91 17.14,73.66 17.78,74.3 21.59,74.3 22.23,74.93 J1.1
N$17
  Top 1.016: R24.2 103.99,52.33 OK8.6
N$18
  Top 1.016: OK1.2 19.98,71.61 R1.2
N$19
  Top 1.016: C3.1 40.01,87.32 J3.2
N$20
  Top 1.016: J9.1 109.22,88.9 109.86,88.27 109.86,70.48 107.31,67.94 T2.4 T2.2 107.31,55.73 R24.1
N$21
  Top 1.016: T2.3 109.61,52.57 OK8.4
N$22
  Top 1.016: T2.1 105.02,60.09 104.14,60.96 104.14,69.22 106.68,71.75 J10.1
N$23
  Top 1.016: J9.2 J10.2
N$24
  Top 1.016: Q9.3 120.65,13.51 121.45,12.7 128.91,12.7 129.54,13.34 J0.1
N$25
  Top 1.016: OK3.1 48.26,76.2 C3.2
N$26
  Top 1.016: OK9.1 R21.1
N$27
  Top 1.016: J7.2 J8.2
N$28
  Top 1.016: R25.2 115.42,52.33 OK9.6
N$29
  Top 1.016: R3.1 39.85,73.51 40.64,74.3 44.45,74.3 45.09,74.93 J3.1
N$30
  Top 1.016: OK3.2 45.58,71.75 R3.2
N$31
  Top 1.016: J11.1 120.65,88.9 121.28,88.27 121.28,70.48 118.75,67.94 T3.4 T3.2 118.75,55.73 R25.1
N$32
  Top 1.016: T3.3 121.05,52.57 OK9.4
N$33
  Top 1.016: C4.1 51.44,87.32 J4.2
N$34
  Top 1.016: C4.2 59.69,76.2 OK4.1
N$35
  Top 1.016: R4.1 51.28,73.51 52.07,74.3 55.88,74.3 56.52,74.93 J4.1
N$36
  Top 1.016: OK4.2 54.27,71.61 R4.2
N$37
  Top 1.016: C5.1 62.87,87.32 J5.2
N$38
  Top 1.016: C5.2 71.12,76.2 OK5.1
N$39
  Top 1.016: R5.1 62.71,73.51 63.5,74.3 67.31,74.3 67.94,74.93 J5.1
N$40
  Top 1.016: Q1.3 8.72,67.31 LED1.C
N$41
  Top 1.016: R42.2 122.55,20.46 D1.A 122.55,17.29 Q9.1
N$42
  Top 1.016: R27.1 LED7.A
N$43
  Top 1.016: R31.1 3.02,69.79 LED1.A
N$44
  Top 1.016: LED2.A 3.02,62.8 R32.1
N$45
  Top 1.016: Q2.3 8.72,60.33 LED2.C
N$46
  Top 1.016: R28.1 LED8.A
N$47
  Top 1.016: LED3.A 3.02,55.82 R33.1
N$48
  Top 1.016: Q3.3 8.67,53.29 LED3.C
N$49
  Top 1.016: R5.2 68.44,71.75 OK5.2
N$50
  Top 1.016: R29.1 LED9.A
N$51
  Top 1.016: C6.1 74.3,87.32 J6.2
N$52
  Top 1.016: R11.1 66.04,62.23 66.82,63.01 OK5.3
N$53
  Top 1.016: C6.2 82.55,76.2 OK6.1
N$55
  Top 1.016: R12.1 77.47,62.23 78.45,63.21 OK6.3
N$57
  Top 1.016: LED4.A 3.02,48.83 R34.1
N$59
  Top 1.016: Q4.3 8.72,46.35 LED4.C
N$61
  Top 1.016: LED10.A R30.1
N$63
  Top 1.016: R35.1 3.02,41.85 LED5.A
N$65
  Top 1.016: Q5.3 8.72,39.37 LED5.C
N$67
  Top 1.016: J7.1 97.79,88.9 98.42,88.27 98.42,70.48 95.89,67.94 T1.4 T1.2 95.89,55.73 R23.1
N$69
  Top 1.016: LED6.A R36.1
N$70
  Top 1.016: Q6.3 8.72,32.38 LED6.C
N$71
  Top 1.016: T1.3 98.19,52.57 OK7.4
N$72
  Top 1.016: T1.1 93.58,60.09 92.71,60.96 92.71,69.22 95.25,71.75 J8.1
N$73
  Top 1.016: T3.1 116.44,60.09 115.57,60.96 115.57,69.22 118.11,71.75 J12.1
N$75
  Top 1.016: J11.2 J12.2
N$77
  Top 1.016: OK10.1 R22.1
N$78
  Top 1.016: R26.2 126.85,52.33 OK10.6
N$81
  Top 1.016: J13.1 132.08,88.9 132.72,88.27 132.72,70.48 130.18,67.94 T4.4 T4.2 130.18,55.73 R26.1
N$82
  Top 1.016: T4.3 132.47,52.57 OK10.4
N$83
  Top 1.016: T4.1 127.88,60.09 127,60.96 127,69.22 129.54,71.75 J14.1
N$84
  Top 1.016: J13.2 J14.2
OUT_1  (via drill 0.61)
  Top 1.016: R27.2 R19.2 v92.71,34.29
  Bottom 1.016: v92.71,34.29 92.71,26.04 92.08,25.4 58.42,25.4 57.78,26.04 57.78,38.1 57.08,38.81 ESP-WROOM-32.25
OUT_2  (via drill 0.61)
  Top 1.016: R28.2 R20.2 v104.14,34.29
  Bottom 1.016: v104.14,34.29 104.14,24.13 103.5,23.5 56.52,23.5 55.88,24.13 55.88,33.02 55.17,33.73 ESP-WROOM-32.27
OUT_3  (via drill 0.61)
  Top 1.016: R29.2 R21.2 v115.57,34.29
  Bottom 1.016: v115.57,34.29 115.57,22.23 114.94,21.59 54.61,21.59 53.98,22.23 53.98,30.48 53.27,31.19 ESP-WROOM-32.28
OUT_4  (via drill 0.61)
  Top 1.016: R30.2 R22.2 v127,34.29
  Bottom 1.016: v127,34.29 127,20.32 126.36,19.68 52.7,19.68 52.07,20.32 52.07,25.4 51.36,26.11 ESP-WROOM-32.30
SCL
  Top 1.016: JP10.3 JP11.3 JP12.3 83.82,32.38 83.34,31.9 R37.1 79.2,31.9 | Q7.2 79.2,31.9 | 79.2,31.9 63.02,31.9 62.87,31.75 | 62.87,31.75 RTC.J1.3 | ESP-WROOM-32.32 62.3,21.03 62.87,21.59 62.87,31.75
SCL_5V
  Top 1.016: JP9.3 JP8.3 JP7.3 R38.1 77.62,15.09 77,15.71 Q7.3
SDA
  Top 1.016: Q8.2 86.19,31.58 86.51,31.9 R39.1 88.27,32 88.27,34.29 87.63,34.92 JP12.4 JP11.4 JP10.4 86.36,43.81 85.72,44.45 65.41,44.45 | RTC.J1.4 65.41,44.45 | 65.41,44.45 52.7,44.45 52.07,43.81 52.07,24.13 51.44,23.5 49.6,23.5 ESP-WROOM-32.31
SDA_5V
  Top 1.016: JP9.4 JP8.4 JP7.4 R40.1 88.75,15.09 89.53,15.88 89.53,20.32 88.9,20.95 84.45,20.95 83.99,21.42 Q8.3

### Text on the board
tNames: IN 1 | IN 2 | IN 3 | IN 4 | IN 5 | IN 6 | OUT 1 | OUT 2 | OUT 3 | OUT 4 | IN 1 | IN 2 | IN 3 | IN 4 | GND | +3.3V | SCL | SDA | v 1.0 | IN 5 | IN 6 | I2C 3.3 V | EnergyPal | by FIlip Havlík, 2025 | OUT 1 | OUT 2 | OUT 3 | OUT 4 | POWER +5V | _ | + | 1-WIRE | +3.3 V | DATA | GND | I2C 5 V | GND | +5V | SCL | SDA